# EAGLE schematic wireless_potentiostat (EAGLE 8.7.0)
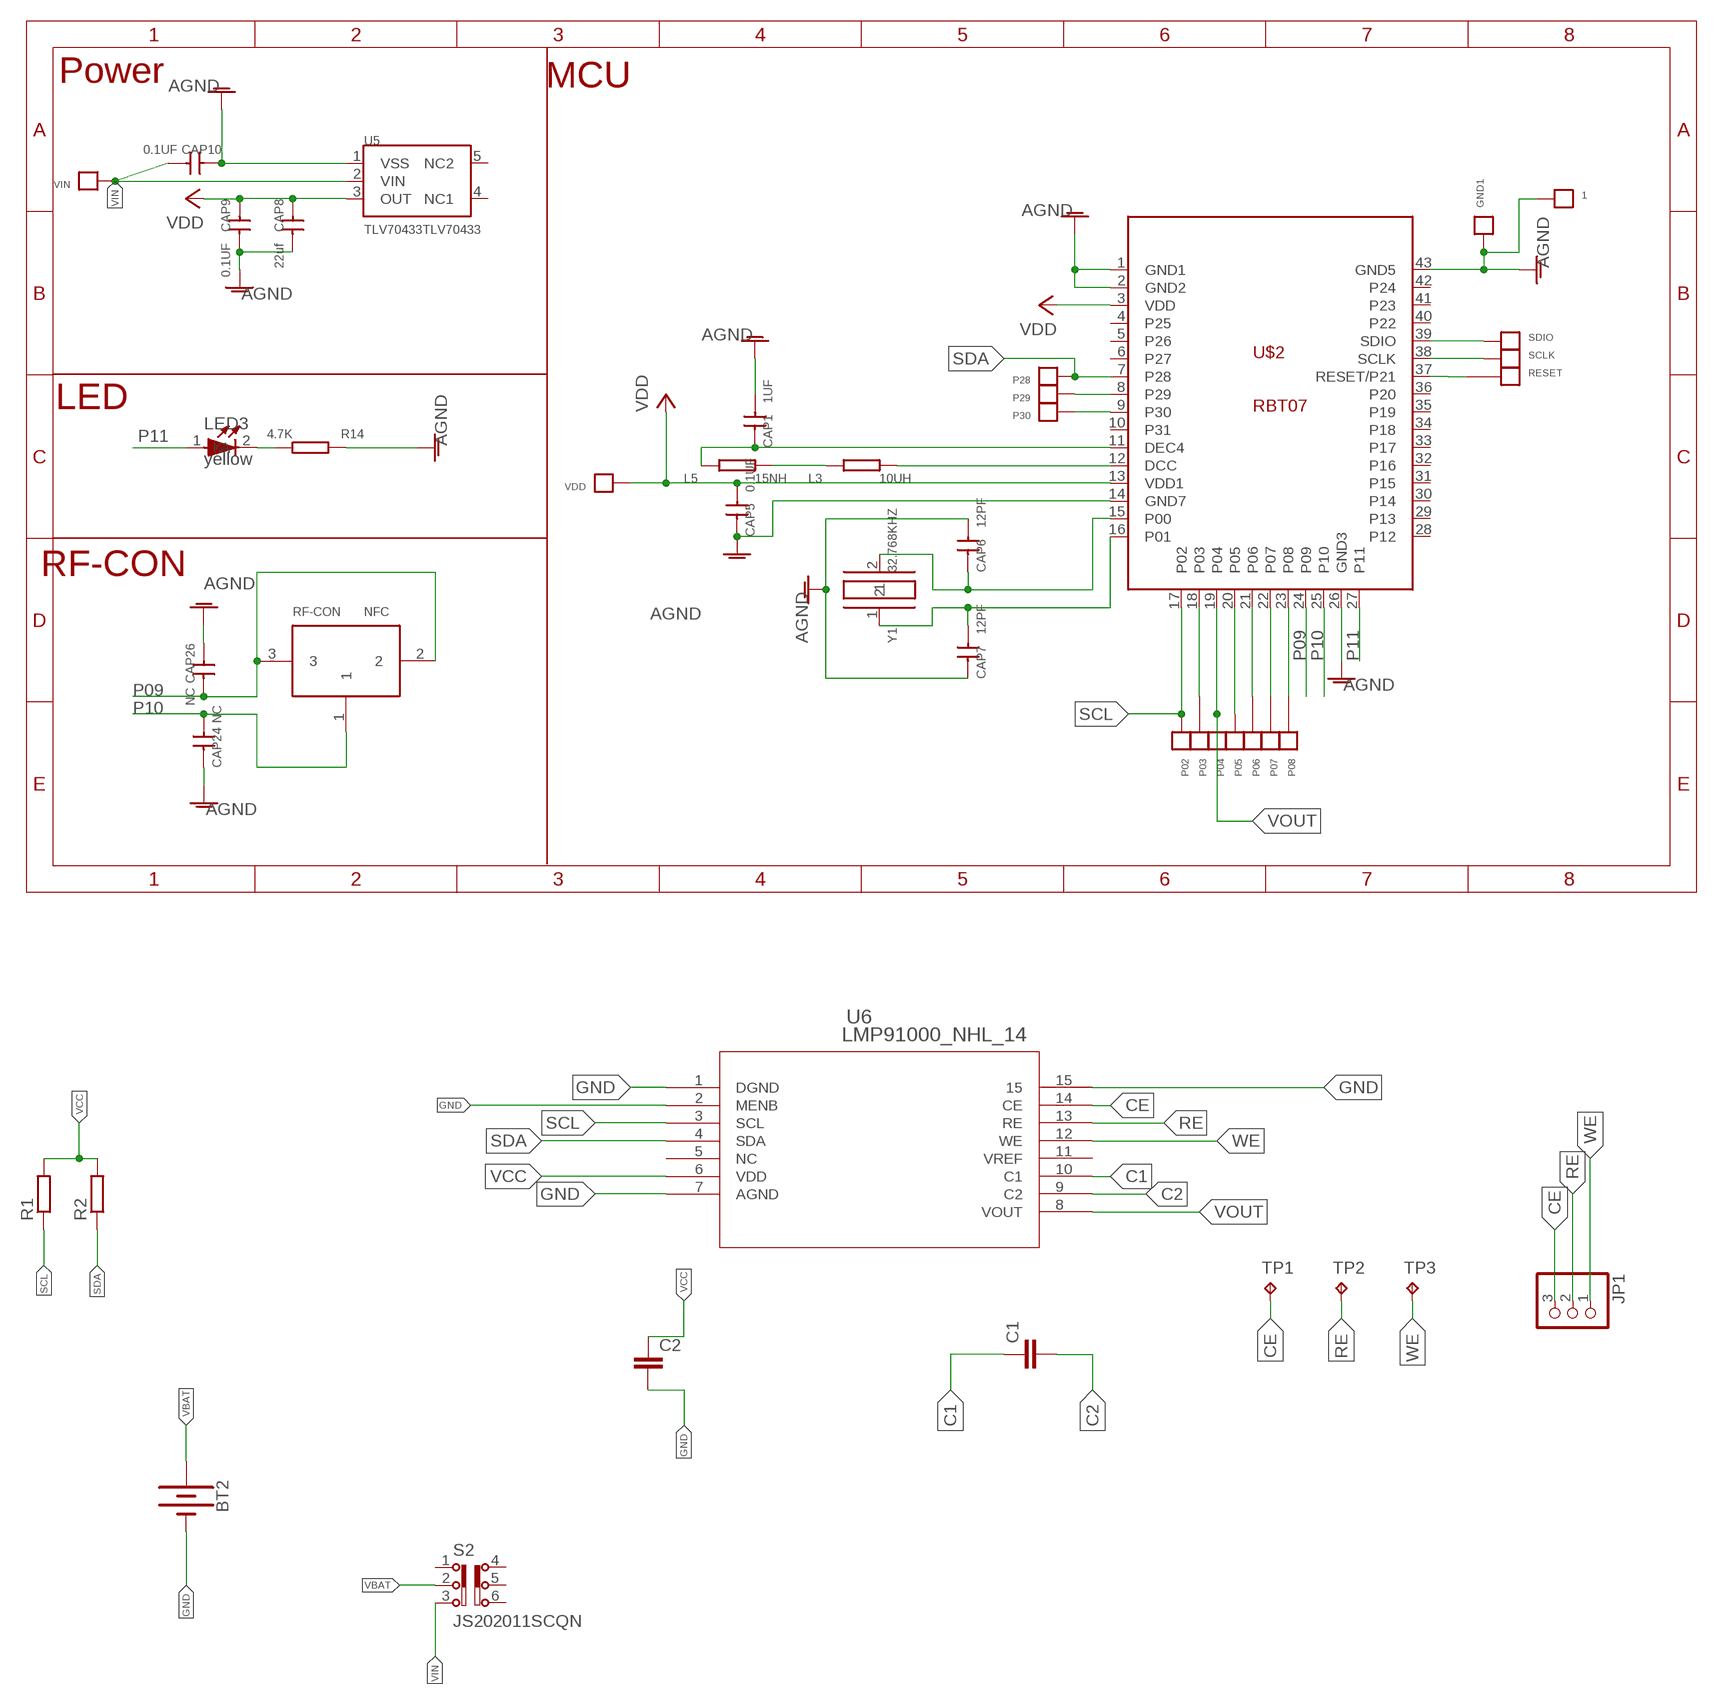
[diagram p0: schematic, sheet 1]

## Parts
1  TPDOT_1  [DOT_1]
BT2  BATTERY-24.5MM_PTH  [BATTCON_24.5MM_PTH]
C1  C-EUC0603  [C0603]
C2  C-EUC0603  [C0603]
CAP1  1UF  CAP0402  [C-0402]
CAP5  0.1UF  CAP0402  [C-0402]
CAP6  12PF  CAP0402  [C-0402]
CAP7  12PF  CAP0402  [C-0402]
CAP8  22uf  CAPC0805  [C0805]
CAP9  0.1UF  CAP0402  [C-0402]
CAP10  0.1UF  CAP0402  [C-0402]
CAP24  NC  CAP0402  [C-0402]
CAP26  NC  CAP0402  [C-0402]
GND1  TPDOT_1.5  [DOT_1.5]
JP1  PINHD-1X3  [1X03]
L3  10UH  RESR0603  [R0603]
L5  15NH  RESR0402  [R0402]
LED3  yellow  LED  [LED0603]
P02  TPDOT_1.5  [DOT_1.5]
P03  1P  [1P]
P04  TPDOT_1.5  [DOT_1.5]
P05  TPDOT_1.5  [DOT_1.5]
P06  1P  [1P]
P07  1P  [1P]
P08  1P  [1P]
P28  TPTPEB  [TPEB]
P29  TPDOT_1.5  [DOT_1.5]
P30  TPDOT_1.5  [DOT_1.5]
R1  R-EU_R0603  [R0603]
R2  R-EU_R0603  [R0603]
R14  4.7K  RESR0402  [R0402]
RESET  1P  [1P]
RF-CON  NFC  IPEXIPEX  [IPEX]
S2  JS202011SCQN  [JS202011SCQN]
SCLK  TPDOT_1.5  [DOT_1.5]
SDIO  TPDOT_1.5  [DOT_1.5]
TP1  TPPAD1-13  [P1-13]
TP2  TPPAD1-13  [P1-13]
TP3  TPPAD1-13  [P1-13]
U5  TLV70433TLV70433  [SOT-23-5]
U6  LMP91000_NHL_14  [SDA14B]
U$2  RBT07  [RBT07]
VDD  TPTPEB  [TPEB]
VIN  TPDOT_1  [DOT_1]
Y1  32.768KHZ  CRY_32153215  [CRY_3215]

## Nets
C1: C1.1 U6.10(C1)
C2: C1.2 U6.9(C2)
CE: JP1.3 TP1.TP U6.14(CE)
GND: 1.1 BT2.2(-) C2.2 CAP1.1 CAP5.2 CAP6.1 CAP7.2 CAP8.1 CAP9.1 CAP10.2 CAP24.2 CAP26.2 GND1.1 R14.1 U5.1(VSS) U6.1(DGND) U6.2(MENB) U6.7(AGND) U6.15 U$2.1(GND1) U$2.2(GND2) U$2.14(GND7) U$2.26(GND3) U$2.43(GND5) ; supply symbol labelled AGND
N$7: L3.1 L5.2
N$8: CAP1.2 L5.1 U$2.11(DEC4)
N$10: L3.2 U$2.12(DCC)
N$11: SDIO.1 U$2.39(SDIO)
N$20: SCLK.1 U$2.38(SCLK)
N$21: RESET.P$1 U$2.37(RESET/P21)
N$28: CAP7.1 U$2.16(P01) Y1.1
N$30: CAP6.2 U$2.15(P00) Y1.2
N$31: P03.P$1 U$2.18(P03)
N$33: P05.1 U$2.20(P05)
N$34: P06.P$1 U$2.21(P06)
N$35: P29.1 U$2.8(P29)
N$37: P07.P$1 U$2.22(P07)
N$38: P08.P$1 U$2.23(P08)
N$39: LED3.2(K) R14.2
N$40: P30.1 U$2.9(P30)
P09: CAP26.1 RF-CON.2 RF-CON.3 U$2.24(P09)
P10: CAP24.1 RF-CON.1 U$2.25(P10)
P11: LED3.1(A) U$2.27(P11)
RE: JP1.2 TP2.TP U6.13(RE)
SCL: P02.1 R1.1 U6.3(SCL) U$2.17(P02)
SDA: P28.1 R2.1 U6.4(SDA) U$2.7(P28)
VBAT: BT2.3(+) S2.2
VCC: C2.1 CAP5.1 CAP8.2 CAP9.2 R1.2 R2.2 U5.3(OUT) U6.6(VDD) U$2.3(VDD) U$2.13(VDD1) VDD.1 ; supply symbol labelled VDD
VIN: CAP10.1 S2.3 U5.2(VIN) VIN.1
VOUT: P04.1 U6.8(VOUT) U$2.19(P04)
WE: JP1.1 TP3.TP U6.12(WE)
Unconnected: S2.1 S2.4 S2.5 S2.6 U5.4(NC1) U5.5(NC2) U6.5(NC) U6.11(VREF) U$2.4(P25) U$2.5(P26) U$2.6(P27) U$2.10(P31) U$2.28(P12) U$2.29(P13) U$2.30(P14) U$2.31(P15) U$2.32(P16) U$2.33(P17) U$2.34(P18) U$2.35(P19) U$2.36(P20) U$2.40(P22) U$2.41(P23) U$2.42(P24)

## Notes on the sheet
- Power | MCU
- LED
- RF-CON

## Library data of the parts
1 GND1 P02 P04 P05 P28-P30 SCLK SDIO VDD VIN = RedBeard:TP
BT2 = SparkFun-Batteries:BATTERY: Battery - Single Cell A variety of battery chemistries, sizes, and footprints. Device List: 20MM_PTH - Coin Cell Battery Holder - 20mm (PTH) <https://www.sparkfun.com/products/783> 6.8MM_PTH - Coin Cell Battery Holder - 6.8MM(SMD) <https://www.digikey.com/product-detail/en/seiko-instruments/MS621FE-FL11E/728-1057-ND/1889208?WT.srch=1&gclid=CNOQ5a6LzdQCFZS2wAodXCkE0g> 12MM_SMD - Coin Cell Battery Holder - 12mm (SMD) <https://www.sparkfun.com/products/10592> 12MM_PTH - Coin Cell Battery Holder - 12mm (PTH) <https://www.sparkfun.com/products/7948> 20MM_SMD - 20mm Coin Cell Battery Holder (SMD) (2 legs) Used on the Big Time Watch Kit <https://www.sparkfun.com/products/11734> 20MM_SMD_4LEGS - Coin Cell Battery Holder - 20mm (SMD) <https://www.sparkfun.com/products/11892> 20MM_SMD_4LEGS_OVERPASTE - Coin Cell Battery Holder - 20mm (SMD) <https://www.sparkfun.com/products/11892> (Over-paste on the legs) 24.5MM_PTH - Coin Cell Battery Holder - 24.5mm (PTH) <https://www.sparkfun.com/products/8863> 9V - 9V Battery Holder - PC Mount Used on the SparkFun SparkPunk Sound Kit <https://www.sparkfun.com/products/11177> and SparkFun SparkPunk Sequencer Kit <https://www.sparkfun.com/products/12707> 18650 - Battery Holder - 18650 (PTH) <https://www.sparkfun.com/products/13113> AA - Battery Holder - 1xAA (PTH) <https://www.sparkfun.com/products/7949> AAA - Battery Holder - 1xAAA (PTH) <https://www.sparkfun.com/products/12718> AA_KIT - Battery Holder - 1xAA (PTH) <https://www.sparkfun.com/products/7949> Special kit package - pads only have exposed copper on one side of the board. AAA_KIT - Battery Holder - 1xAAA (PTH) <https://www.sparkfun.com/products/12718> Special kit package - pads only have exposed copper on one side of the board.; SF_SKU: PRT-08863
C1 C2 = rcl:C-EU: CAPACITOR, European symbol; SPICEPREFIX: C
CAP1 CAP5-CAP9 CAP24 = NANO2:CAP: CAP
CAP10 CAP26 = 1RedBeard:CAP: CAP
JP1 = pinhead:PINHD-1X3: PIN HEADER
L3 L5 R14 = 1RedBeard:RES: RES
LED3 = RedBeard:LED: LED
P03 P06-P08 RESET = 1RedBeard:1P
R1 R2 = rcl:R-EU_: RESISTOR, European symbol; SPICEPREFIX: R
RF-CON = RedBeard:IPEX
S2 = switch-ck:JS202011SCQN: DPDT SLIDE SWITCH
TP1-TP3 = testpad:TP: Test pad
U5 = NANO2:TLV70433: TLV70433; U1: TLV70433DBVR
U6 = LMP91000:LMP91000_NHL_14; BASEPN: LMP91000; DATASHEETURL: httpwww.ti.comlitdssymlinklmp91000.pdf; MANUFACTURER: Texas Instruments; MANUFACTURER_PART_NUMBER: lmp91000_nhl_14; NSC_PACKAGEREFERENCE: SDA14B; VENDOR: Texas Instruments
U$2 = 1RedBeard:RBT07
Y1 = RedBeard:CRY_3215

## Net classes
0 default: clearance 0.205 mm
2 Power: width 0.203 mm, drill 0.305 mm, clearance 0.152 mm to class 0, clearance 0.152 mm to class 1, clearance 0.152 mm